# EAGLE design StepServo (EAGLE 8.2.2)
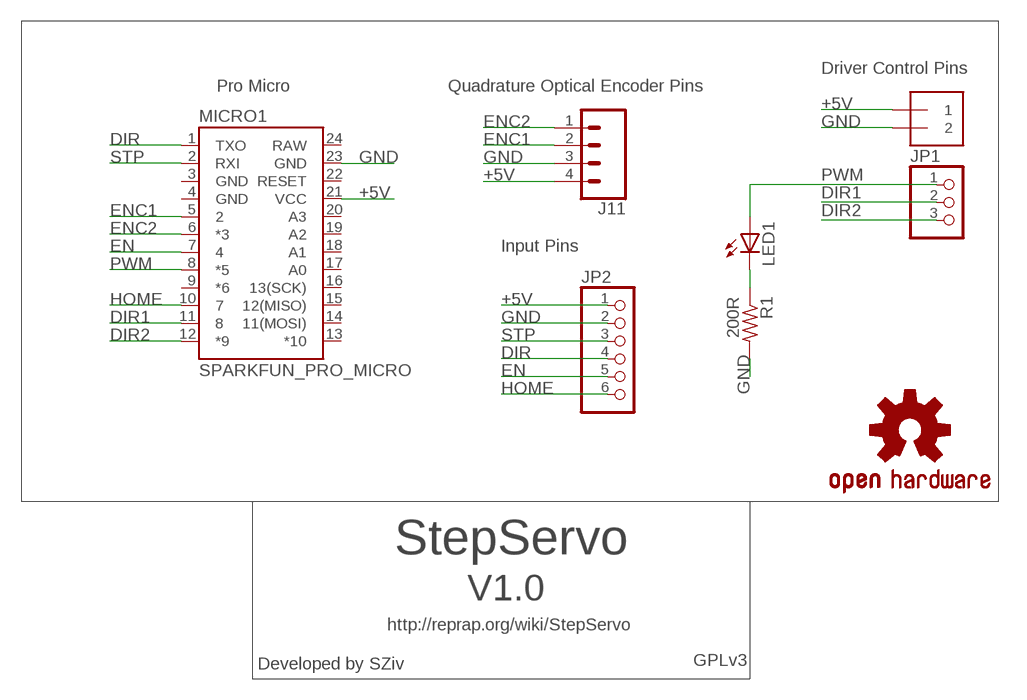
[diagram p0: schematic, sheet 1]

## Parts
J2  1X2-3.5MM  [1X2-3.5MM]
J11  CONN_04  [1X04]
JP1  PINHD-1X3  [1X03]
JP2  PINHD-1X6  [1X06]
LED1  LED3MM  [LED3MM]
LOGO1  OSHW-LOGOL  [OSHW-LOGO-L]
MICRO1  SPARKFUN_PRO_MICRO  [SPARKFUN_PRO_MICRO]
R1  200R  R-US_0207/7  [0207/7]

## Nets
+5V: J2.1 J11.4 JP2.1 MICRO1.21(VCC)
DIR: JP2.4 MICRO1.1(TXO)
DIR1: JP1.2 MICRO1.11
DIR2: JP1.3 MICRO1.12(*9)
EN: JP2.5 MICRO1.7
ENC1: J11.2 MICRO1.5
ENC2: J11.1 MICRO1.6(*3)
GND: J2.2 J11.3 JP2.2 MICRO1.23(GND) R1.2
HOME: JP2.6 MICRO1.10
N$1: LED1.K(C) R1.1
PWM: JP1.1 LED1.A MICRO1.8(*5)
STP: JP2.3 MICRO1.2(RXI)
Unconnected: MICRO1.9(*6) MICRO1.13(*10) MICRO1.14(11(MOSI)) MICRO1.15(12(MISO)) MICRO1.16(13(SCK)) MICRO1.17(A0) MICRO1.18(A1) MICRO1.19(A2) MICRO1.20(A3) MICRO1.22(RESET)

## Notes on the sheet
- Driver Control Pins
- Pro Micro | Quadrature Optical Encoder Pins
- Input Pins
- StepServo
- V1.0
- http://reprap.org/wiki/StepServo
- Developed by SZiv | GPLv3

## Power pins joined to a net without a drawn wire
GND: MICRO1.3(GND) MICRO1.4(GND)
RAW: MICRO1.24(RAW)

## Library data of the parts
J2 = adafruit:1X2: 3.5mm Terminal block http://www.ladyada.net/library/pcb/eaglelibrary.html
J11 = SparkFun-Connectors:CONN_04: Multi connection point. Often used as Generic Header-pin footprint for 0.1 inch spaced/style header connections On any of the 0.1 inch spaced packages, you can populate with these: Break Away Headers - Straight <https://www.sparkfun.com/products/116> (PRT-00116) Break Away Male Headers - Right Angle <https://www.sparkfun.com/products/553> (PRT-00553) Female Headers <https://www.sparkfun.com/products/115> (PRT-00115) Break Away Headers - Machine Pin <https://www.sparkfun.com/products/117> (PRT-00117) Break Away Female Headers - Swiss Machine Pin <https://www.sparkfun.com/products/743> (PRT-00743) For SCREWTERMINALS and SPRING TERMINALS visit here: Screw Terimnals on SparkFun.com <https://www.sparkfun.com/search/results?term=Screw+Terminals> (5mm/3.5mm/2.54mm spacing) This device is also useful as a general connection point to wire up your design to another part of your project. Our various solder wires solder well into these plated through hole pads. Hook-Up Wire - Assortment (Stranded, 22 AWG) <https://www.sparkfun.com/products/11375> (PRT-11375) Hook-Up Wire - Assortment (Solid Core, 22 AWG) <https://www.sparkfun.com/products/11367> (PRT-11367) View the entire wire category on our website here <https://www.sparkfun.com/categories/141> Special notes: Molex polarized connector foot print use with SKU : PRT-08231 with associated crimp pins and housings. 1MM SMD Version SKU: PRT-10208; PROD_ID: CONN-09696
JP1 = adafruit:PINHD-1X3: PIN HEADER
JP2 = adafruit:PINHD-1X6: PIN HEADER
LED1 = adafruit:LED: LED OSRAM: - CHIPLED LG R971, LG N971, LY N971, LG Q971, LY Q971, LO R971, LY R971 LH N974, LH R974 LS Q976, LO Q976, LY Q976 LO Q996 - Hyper CHIPLED LW Q18S LB Q993, LB Q99A, LB R99A - SideLED LS A670, LO A670, LY A670, LG A670, LP A670 LB A673, LV A673, LT A673, LW A673 LH A674 LY A675 LS A676, LA A676, LO A676, LY A676, LW A676 LS A679, LY A679, LG A679 - Hyper Micro SIDELED® LS Y876, LA Y876, LO Y876, LY Y876 LT Y87S - SmartLED LW L88C, LW L88S LB L89C, LB L89S, LG L890 LS L89K, LO L89K, LY L89K LS L896, LA L896, LO L896, LY L896 - TOPLED LS T670, LO T670, LY T670, LG T670, LP T670 LSG T670, LSP T670, LSY T670, LOP T670, LYG T670 LG T671, LOG T671, LSG T671 LB T673, LV T673, LT T673, LW T673 LH T674 LS T676, LA T676, LO T676, LY T676, LB T676, LH T676, LSB T676, LW T676 LB T67C, LV T67C, LT T67C, LS T67K, LO T67K, LY T67K, LW E67C LS E67B, LA E67B, LO E67B, LY E67B, LB E67C, LV E67C, LT E67C LW T67C LS T679, LY T679, LG T679 LS T770, LO T770, LY T770, LG T770, LP T770 LB T773, LV T773, LT T773, LW T773 LH T774 LS E675, LA E675, LY E675, LS T675 LS T776, LA T776, LO T776, LY T776, LB T776 LHGB T686 LT T68C, LB T68C - Hyper Mini TOPLED® LB M676 - Mini TOPLED Santana® LG M470 LS M47K, LO M47K, LY M47K Source: http://www.osram.convergy.de/
LOGO1 = SparkFun-Aesthetics:OSHW-LOGO: Open-Source Hardware (OSHW) Logo This logo indicates the piece of hardware it is found on incorporates a OSHW license and/or adheres to the definition of open source hardware found here: http://freedomdefined.org/OSHW
MICRO1 = SparkFun-Boards:SPARKFUN_PRO_MICRO: SparkFun Pro Micro Atmega32U4 compatible footprint. SparkFun Products: 3.3V/8MHz <https://www.sparkfun.com/products/12587> 5V/16MHz <https://www.sparkfun.com/products/12640>
R1 = adafruit:R-US_: RESISTOR, American symbol

## Board
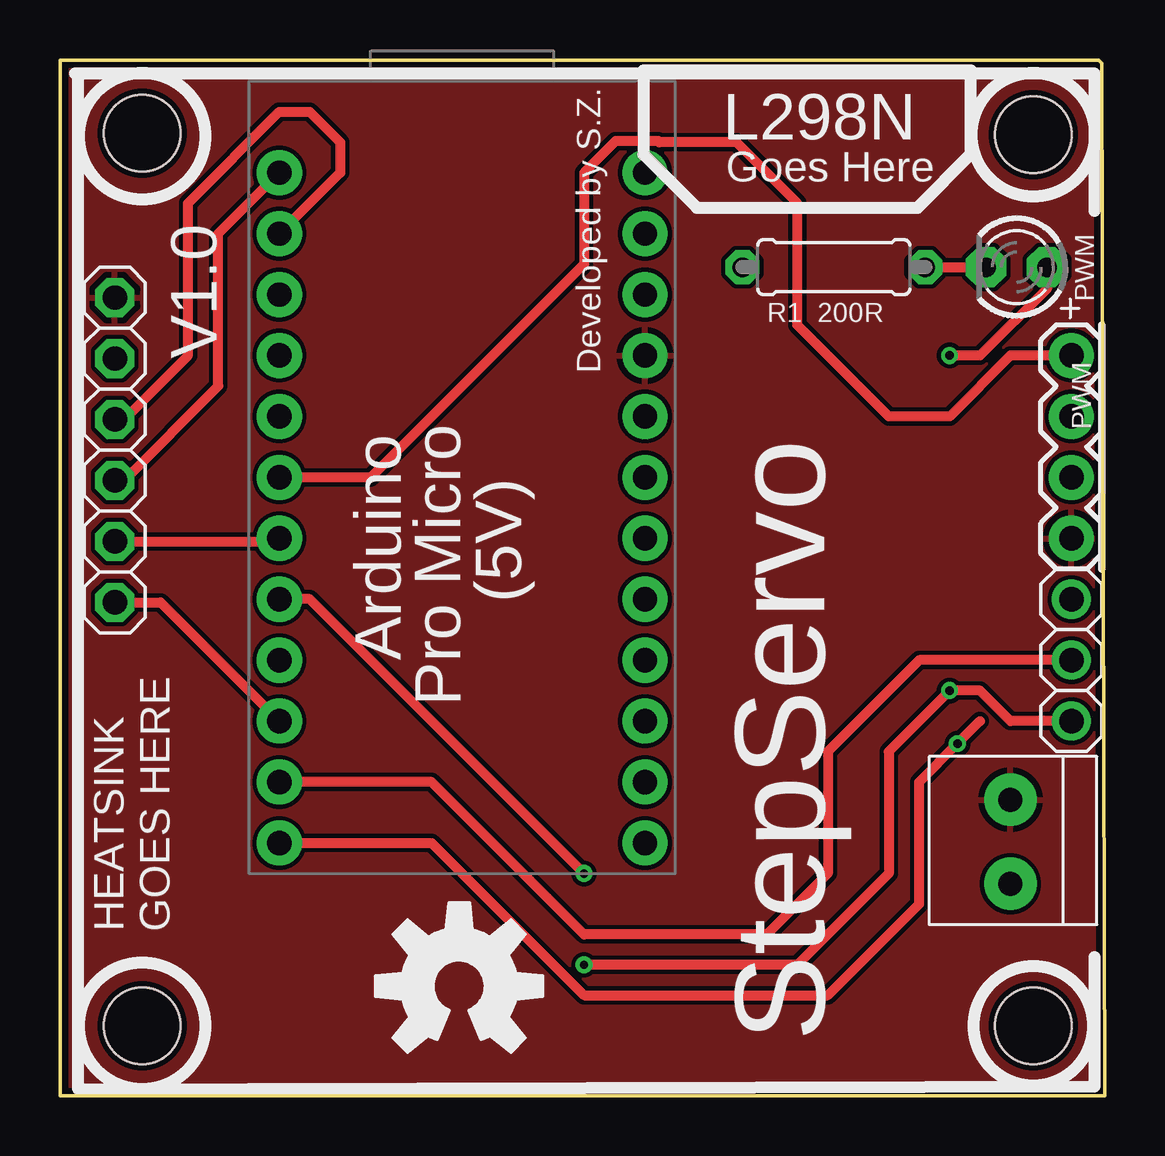
[diagram p1: board, top side]
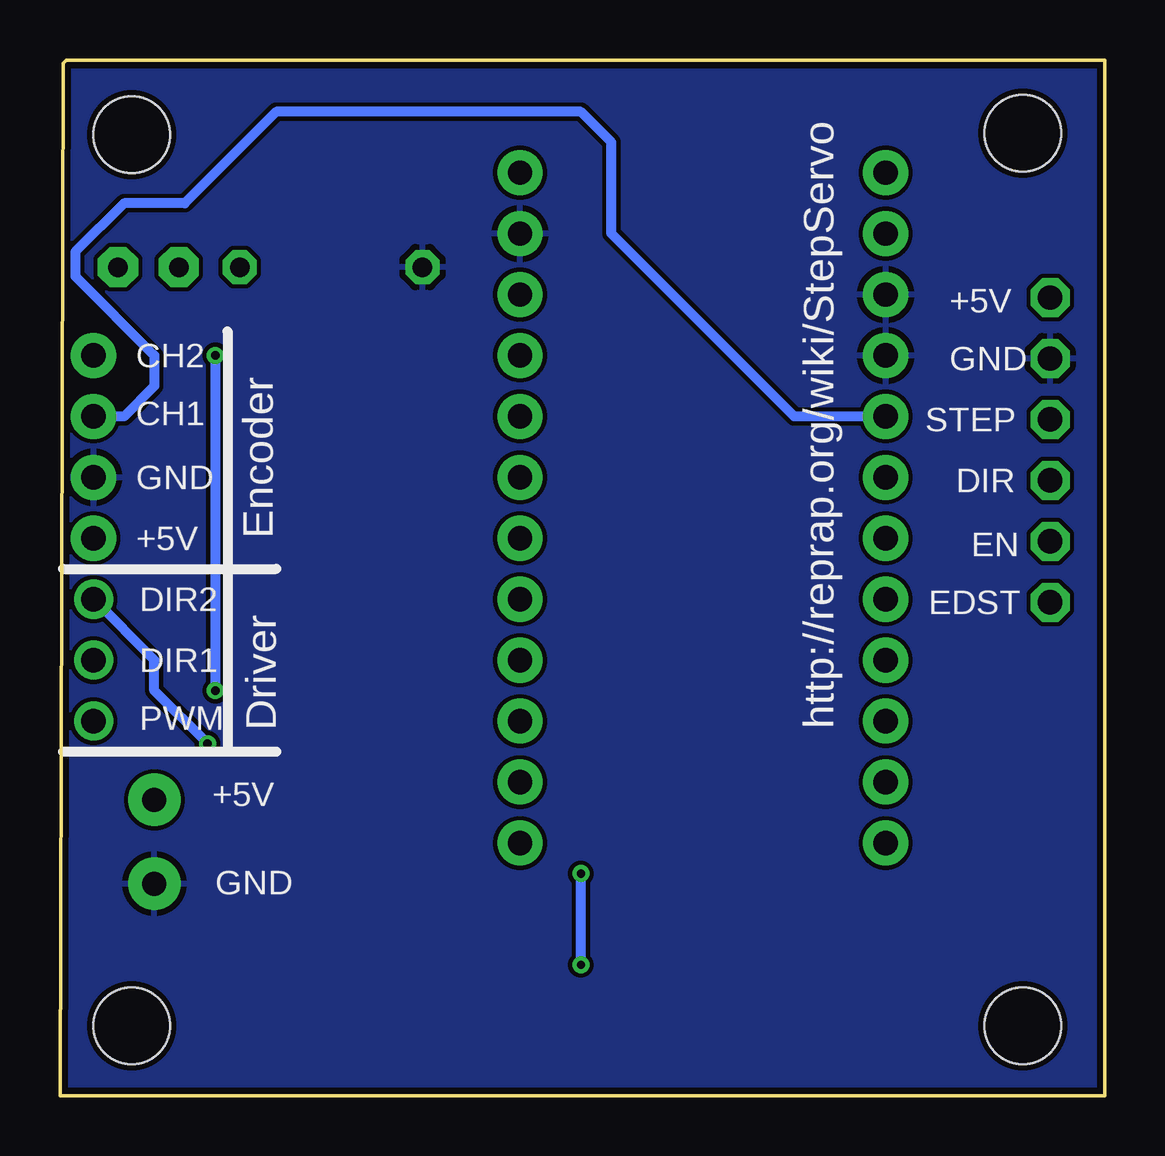
[diagram p2: board, bottom side, seen from below]

Size 43.56 x 43.18 mm. Coordinates in mm from the lower left corner, seen from the top.
Outline: 0,0 43.56,0 43.43,43.05 43.31,43.18 0,43.18 0,0
Copper layers (1*16): Top 0.035mm / dielectric 1.5mm / Bottom 0.035mm
Design rules "GoldPhoenix": minimum track width 7mil, minimum drill 15mil, track to track 7mil, track to pad 7mil, pad to pad 7mil, via to via 7mil, smd to smd 7mil, copper to edge 10mil, drill to drill 8mil, minimum pad ring 12mil, minimum via ring 7mil, stop-mask expansion 4mil, vias tented up to drill 25mil, thermal gap 10mil
Holes 3.2 mm at 3.43,2.92 40.58,2.92 40.58,40.07 3.43,40.13

### Footprints (pad centres in the part's own frame; a part is rotated, then mirrored left to right if it is on the bottom)
1X2-3.5MM = drill 1 pad 2.184: 1 1.8,0; 2 -1.7,0
1X04 = drill 1.016 pad 1.88: 1 0,0; 2 2.54,0; 3 5.08,0; 4 7.62,0
1X03 = drill 1.016: 1 -2.54,0; 2 0,0; 3 2.54,0
1X06 = drill 1.016 octagon: 1 -6.35,0; 2 -3.81,0; 3 -1.27,0; 4 1.27,0; 5 3.81,0; 6 6.35,0
LED3MM = drill 0.813 pad 1.676 octagon: A -1.27,0; K 1.27,0
SPARKFUN_PRO_MICRO = drill 1.016 pad 1.88: 1 -7.62,12.7; 2 -7.62,10.16; 3 -7.62,7.62; 4 -7.62,5.08; 5 -7.62,2.54; 6 -7.62,0; 7 -7.62,-2.54; 8 -7.62,-5.08; 9 -7.62,-7.62; 10 -7.62,-10.16; 11 -7.62,-12.7; 12 -7.62,-15.24; 13 7.62,-15.24; 14 7.62,-12.7; 15 7.62,-10.16; 16 7.62,-7.62; 17 7.62,-5.08; 18 7.62,-2.54; 19 7.62,0; 20 7.62,2.54; 21 7.62,5.08; 22 7.62,7.62; 23 7.62,10.16; 24 7.62,12.7
0207/7 = drill 0.813 octagon: 1 -3.81,0; 2 3.81,0

### Placement (x,y rotation side)
J2  39.62,10.54 90 top
J11  42.16,30.86 270 top
JP1  42.16,18.16 90 top
JP2  2.29,26.92 270 top
LED1  39.88,34.54 180 top
LOGO1  16.64,4.57 0 top
MICRO1  16.76,25.78 0 top
R1  32.26,34.54 180 top

### Tracks (layer width: path | path; a pad name or v marks a point on that pad's centre or on a via)
+5V
  Top 0.406: J11.4 42.37,23.24
  Top 0.61: J11.4 42.37,23.24
  pour Top: -1.02,43.56 44.7,43.56 44.7,37.21 44.7,-0.89 -1.02,-0.89
DIR
  Top 0.406: JP2.4 2.67,25.65 6.6,29.59 6.6,35.94 MICRO1.1
DIR1
  Top 0.406: JP1.2 35.81,18.16 32,14.35 32,9.27 29.46,6.73 21.84,6.73 15.49,13.08 MICRO1.11
DIR2  (via drill 0.35)
  Top 0.406: MICRO1.12 15.49,10.54 21.84,4.19 32,4.19 35.81,8 35.81,13.08 v37.41,14.68 38.35,15.62
  Bottom 0.406: v37.41,14.68 39.62,16.89 39.62,18.16 JP1.3
EN
  Top 0.406: JP2.5 9.02,23.11 MICRO1.7
ENC1
  Bottom 0.406: MICRO1.5 12.95,28.32 20.57,35.94 20.57,39.75 21.84,41.02 34.54,41.02 38.35,37.21 40.89,37.21 42.92,35.18 42.92,34.16 39.62,30.86 39.62,29.59 40.89,28.32 J11.2
ENC2
  Top 0.406: J11.1 39.62,30.86 37.08,28.32 34.54,28.32 30.73,32.13 30.73,37.21 28.19,39.75 24.98,39.75 24.93,39.8 23.17,39.8 21.84,38.48 21.84,34.67 12.95,25.78 MICRO1.6
GND
  pour Bottom: -1.02,0.38 -1.02,43.56 43.43,43.56 43.43,-0.89 -1.02,-0.89
HOME
  Top 0.406: JP2.6 4.19,20.57 MICRO1.10
N$1
  Top 0.406: R1.1 LED1.K
PWM  (via drill 0.35)
  Top 0.406: LED1.A 41.15,33.66 38.35,30.86 v37.08,30.86 | JP1.1 39.62,15.62 38.35,16.89 v37.08,16.89 34.54,14.35 34.54,9.27 30.73,5.46 v21.84,5.46 | v21.84,9.27 10.41,20.7 MICRO1.8
  Bottom 0.406: v37.08,30.86 v37.08,16.89 | v21.84,5.46 v21.84,9.27
STP
  Top 0.406: MICRO1.2 11.68,38.48 11.68,39.75 10.41,41.02 9.14,41.02 5.33,37.21 5.33,30.86 2.67,28.19 JP2.3

### Text on the board
tPlace: Developed by S.Z. | L298N | Goes Here | PWM | R1 200R | V1.0 | PWM | (5V) | Arduino | Pro Micro | HEATSINK / GOES HERE | StepServo
bPlace: http://reprap.org/wiki/StepServo | +5V | GND | CH2 | STEP | CH1 | DIR | GND | Encoder | EN | +5V | EDST | DIR2 | DIR1 | Driver | PWM | +5V | GND